# EAGLE schematic RoboKit (EAGLE 9.6.2)
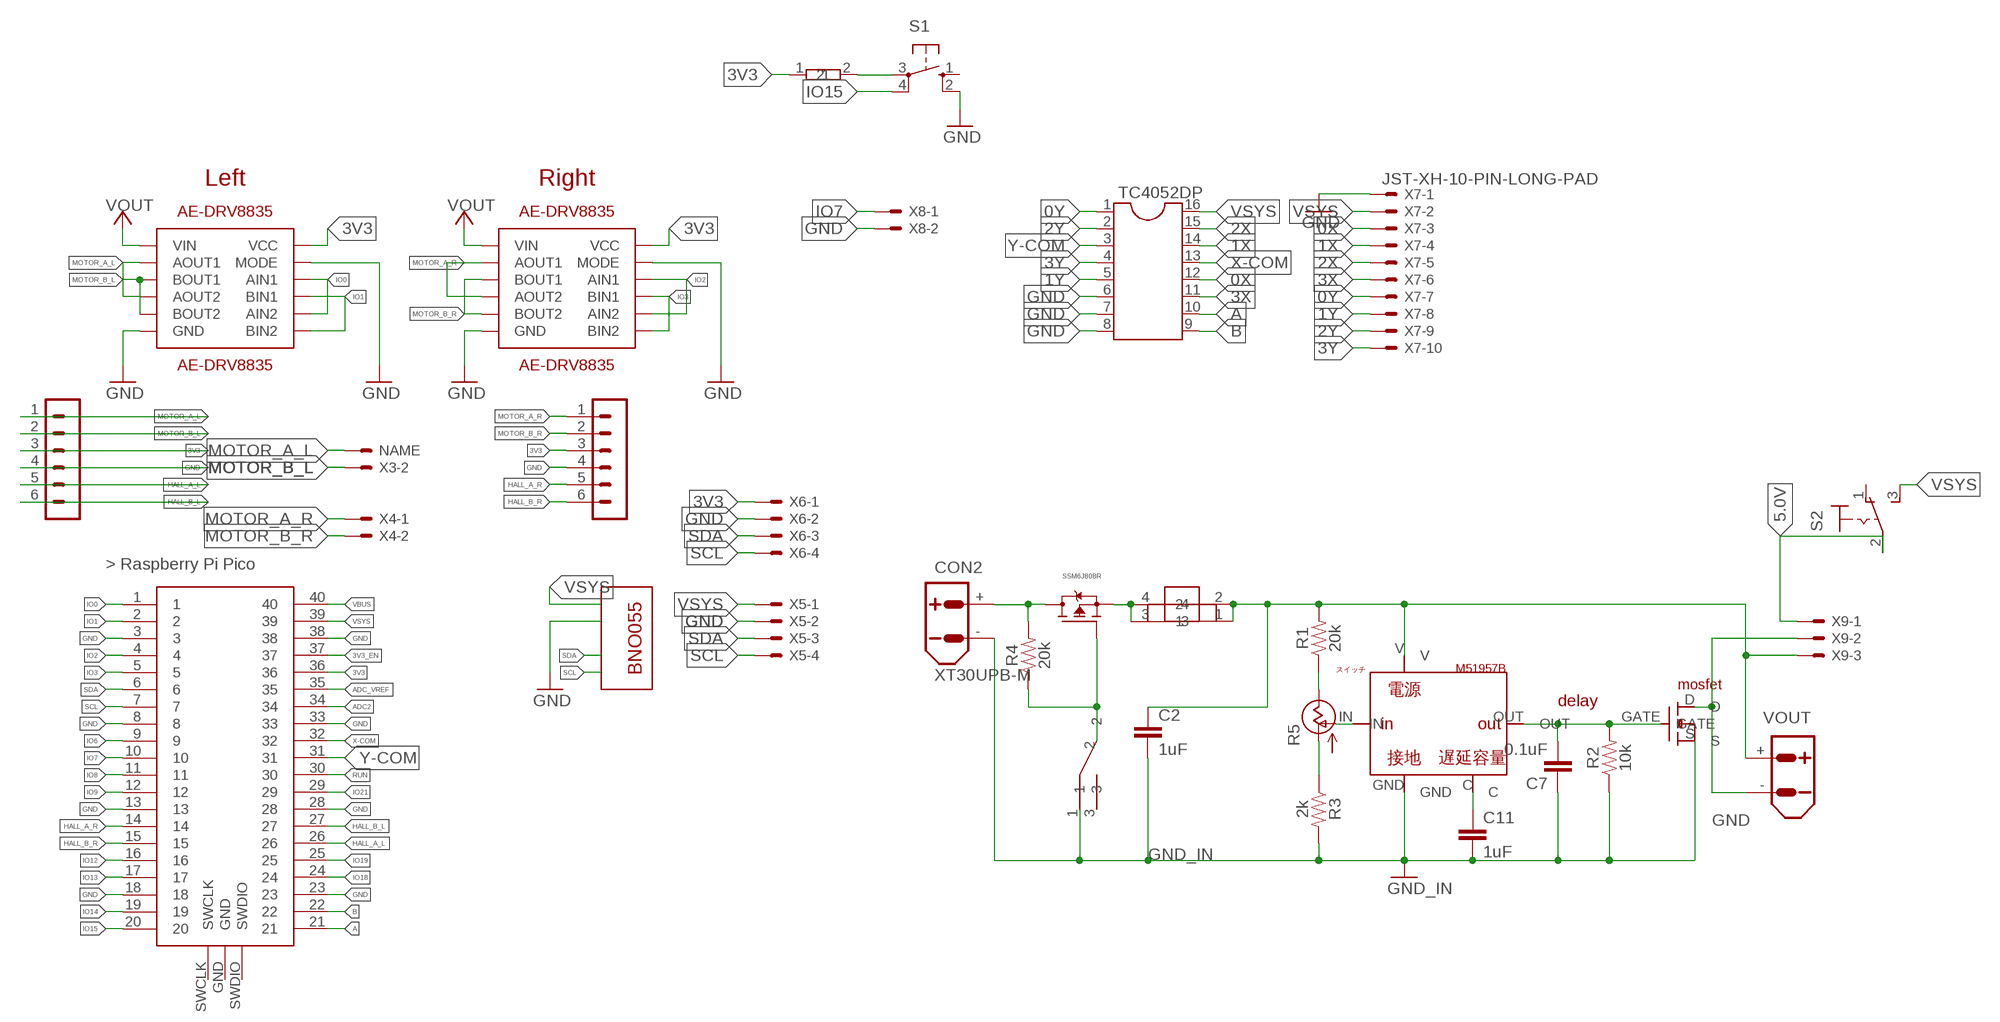
[diagram p0: schematic, sheet 1]

## Parts
C2  1uF  C-EUC0603  [C0603]
C7  0.1uF  4.7UF0603  [0603]
C11  1uF  C-EUC0603  [C0603]
CON1  XT30UPB-M  [XT30UPB-M]
CON2  XT30UPB-M  [XT30UPB-M]
CONNECTOR1  RESISTER  [RESISTER_SOCKET]
P1  B6B-PH-K  [B6B-PH-K]
P2  B6B-PH-K  [B6B-PH-K]
R1  20k  10KOHM-0603-1/10W-1%  [0603]
R2  10k  1KOHM-0603-1/10W-1%  [0603]
R3  2k  1KOHM-0603-1/10W-1%  [0603]
R4  20k  10KOHM-0603-1/10W-1%  [0603]
R5  1k  POTTRS64W  [S64W]
S1  10-XX  [B3F-10XX]
S2  320-916  [320-916]
TC4052DP  DIL16  [DIL16]
U1  SSM6J808R  [SSM6J808R]
U$1  RASPBERRY-PI-PICO_TH  [FT_RASPBERRY-PI-PICO_TH]
U$2  AE-DRV8835  [AE-DRV8835]
U$3  AE-DRV8835  [AE-DRV8835]
U$4  AE-BNO055-BO  [AE-BNO055-BO]
U$5  M51957  [SOP-8]
U$6  BSC093N04LSGATMA1  [MOSFET_BSC093N04LSGATMA1]
U$7  FUSE  [FUSE]
U$9  SW  [SW]
X3  JST-XH-02-PIN-LONG-PAD  [JST-XH-02-PACKAGE-LONG-PAD]
X4  JST-XH-02-PIN-LONG-PAD  [JST-XH-02-PACKAGE-LONG-PAD]
X5  JST-XH-04-PIN-LONG-PAD  [JST-XH-04-PACKAGE-LONG-PAD]
X6  JST-XH-04-PIN-LONG-PAD  [JST-XH-04-PACKAGE-LONG-PAD]
X7  JST-XH-10-PIN-LONG-PAD  [JST-XH-10-PACKAGE-LONG-PAD]
X8  JST-XH-02-PIN-LONG-PAD  [JST-XH-02-PACKAGE-LONG-PAD]
X9  JST-XH-03-PIN-LONG-PAD  [JST-XH-03-PACKAGE-LONG-PAD]

## Nets
0X: TC4052DP.12 X7.3
0Y: TC4052DP.1 X7.7
1X: TC4052DP.14 X7.4
1Y: TC4052DP.5 X7.8
2X: TC4052DP.15 X7.5
2Y: TC4052DP.2 X7.9
3V3 [power]: CONNECTOR1.1 P1.3 P2.3 U$1.36 U$2.VCC U$3.VCC X6.1
3V3_EN [power]: U$1.37
3X: TC4052DP.11 X7.6
3Y: TC4052DP.4 X7.10
5.0V [power]: S2.2(P) X9.1
A: TC4052DP.10 U$1.21
ADC2: U$1.34
ADC_VREF: U$1.35
B: TC4052DP.9 U$1.22
GND: CON1.- P1.4 P2.4 S1.2(S1) TC4052DP.6 TC4052DP.7 TC4052DP.8 U$1.3 U$1.8 U$1.13 U$1.18 U$1.23 U$1.28 U$1.33 U$1.38 U$2.GND U$2.MODE U$3.GND U$3.MODE U$4.GND U$6.D X5.2 X6.2 X7.1 X8.2 X9.2
GND_IN: C2.2 C7.1 C11.2 CON2.- R2.1 R3.2 U$5.GND U$6.S U$9.1
HALL_A_L: P2.5 U$1.26
HALL_A_R: P1.5 U$1.14
HALL_B_L: P2.6 U$1.27
HALL_B_R: P1.6 U$1.15
IO0: U$1.1 U$2.INA1(AIN1) U$2.INA2(AIN2)
IO1: U$1.2 U$2.INB1(BIN1) U$2.INB2(BIN2)
IO2: U$1.4 U$3.INA1(AIN1) U$3.INA2(AIN2)
IO3: U$1.5 U$3.INB1(BIN1) U$3.INB2(BIN2)
IO6: U$1.9
IO7: U$1.10 X8.1
IO8: U$1.11
IO9: U$1.12
IO12: U$1.16
IO13: U$1.17
IO14: U$1.19
IO15: S1.4(P1) U$1.20
IO18: U$1.24
IO19: U$1.25
IO21: U$1.29
MOTOR_A_L: P2.1 U$2.AOUT1 U$2.AOUT2 X3.1
MOTOR_A_R: P1.1 U$3.AOUT1 U$3.AOUT2 X4.1
MOTOR_B_L: P2.2 U$2.BOUT1 U$2.BOUT2 X3.2
MOTOR_B_R: P1.2 U$3.BOUT1 U$3.BOUT2 X4.2
N$1: R5.S(OUT) U$5.IN
N$2: R3.1 R5.A(VDD)
N$3: R1.1 R5.E(VSS)
N$4: CONNECTOR1.2 S1.3(P)
N$5: C11.1 U$5.C
N$6: C7.2 R2.2 U$5.OUT U$6.GATE
N$7: R4.1 U1.G U$9.2
RUN: U$1.30
SCL: U$1.7 U$4.SCL X5.4 X6.4
SDA: U$1.6 U$4.SDA X5.3 X6.3
V_HIGH [power]: U1.S U$7.3 U$7.4
VBUS [power]: U$1.40
VIN [power]: CON2.+ R4.2 U1.D
VOUT [power]: C2.1 CON1.+ R1.2 U$2.VIN U$3.VIN U$5.V U$7.1 U$7.2 X9.3
VSYS [power]: S2.3(S) TC4052DP.16 U$1.39 U$4.VIN X5.1 X7.2
X-COM: TC4052DP.13 U$1.32
Y-COM: TC4052DP.3 U$1.31
Unconnected: S1.1(S) S2.1(O) U$1.GND U$1.SWCLK U$1.SWDIO U$9.3

## Notes on the sheet
- Left | Right
- スイッチ | M51957B
- mosfet
- delay

## Library data of the parts
C2 C11 = resistor:C-EU: CAPACITOR, European symbol
C7 = SparkFun-Capacitors:4.7UF: 4.7µF ceramic capacitors A capacitor is a passive two-terminal electrical component used to store electrical energy temporarily in an electric field.; PROD_ID: CAP-08280; VALUE: 4.7uF
CON1 CON2 = XTn0 amass:XT30: AMASS XT30 connector Store in Japan AMASS XT30 connector <https://szc.jp/ams-xt30>
CONNECTOR1 = resistor:RESISTER: resister
P1 P2 = con-jst-ph:B6B-PH-K: HEADER
R1 R4 = SparkFun-Resistors:10KOHM: 10kΩ resistor A resistor is a passive two-terminal electrical component that implements electrical resistance as a circuit element. Resistors act to reduce current flow, and, at the same time, act to lower voltage levels within circuits. - Wikipedia; PROD_ID: RES-00824; VALUE: 10k
R2 R3 = SparkFun-Resistors:1KOHM: 1kΩ resistor A resistor is a passive two-terminal electrical component that implements electrical resistance as a circuit element. Resistors act to reduce current flow, and, at the same time, act to lower voltage levels within circuits. - Wikipedia; PROD_ID: RES-07856; VALUE: 1k
R5 = Values of parts:POTTR: POTENTIOMETER
S1 = switch-omron:10-XX: OMRON SWITCH; MPN: B3F-1000; OC_FARNELL: 176432; OC_NEWARK: 36M3542
S2 = switch:320-916: TOGGLE SWITCH distributor RS Components
TC4052DP = ic-package:DIL16: Dual In Line / Socket
U1 = SSM6J808R:SSM6J808R: PchMOSFET; A1_MIN: 0.8; A_MAX: 0.8; A_MIN: 0.8; A_NOM: 0.8; B_MAX: 0.41; B_MIN: 0.43; B_NOM: 0.42; D2_MAX: 0.0; D_MAX: 2.7; D_MIN: 3.1; D_NOM: 2.9; E1_MAX: 2.1; E1_MIN: 2.3; E1_NOM: 2.2; E2_MAX: 0.0; ENOM: 0.95; E_MAX: 2.7; E_MIN: 2.9; E_NOM: 2.8; L_MAX: 0.4; L_MIN: 0.2; L_NOM: 0.3; MANUFACTURER: Toshiba; PIN_COUNT: 6.0; STANDARD: IPC 7351B
U$1 = pipico:RASPBERRY-PI-PICO_TH: Raspberry Pi Pico microcontroller board for through-hole mounting.
U$2 U$3 = AE-DRV8835:AE-DRV8835
U$4 = AE-BNO055:AE-BNO055-BO
U$5 = M51957B:M51957
U$6 = MOSFET_BSC093N04LSGATMA1:BSC093N04LSGATMA1
U$7 = fuse:FUSE: FUSEソケット CQ-122(PF) http://eleshop.jp/shop/g/gA3V412/
U$9 = akizuki sw:SW
X3 X4 X8 = Rembrandt Electronics - JST XH Connectors v1-0:JST-XH-02-PIN: JST XH Connector 2 Pin Wire to board connector. Pitch: 2,54 mm, (0.100") Number of pins: 2 Created by Rembrandt Electronics www.rembrandtelectronics.com
X5 X6 = Rembrandt Electronics - JST XH Connectors v1-0:JST-XH-04-PIN: JST XH Connector 2 Pin Wire to board connector. Pitch: 2,54 mm, (0.100") Number of pins: 4 Created by Rembrandt Electronics www.rembrandtelectronics.com
X7 = Rembrandt Electronics - JST XH Connectors v1-0:JST-XH-10-PIN: JST XH Connector 2 Pin Wire to board connector. Pitch: 2,54 mm, (0.100") Number of pins: 10 Created by Rembrandt Electronics www.rembrandtelectronics.com
X9 = Rembrandt Electronics - JST XH Connectors v1-0:JST-XH-03-PIN: JST XH Connector 2 Pin Wire to board connector. Pitch: 2,54 mm, (0.100") Number of pins: 3 Created by Rembrandt Electronics www.rembrandtelectronics.com

## Net classes
0 default: width 0.75 mm
2 power: width 1.8 mm, drill 0.102 mm